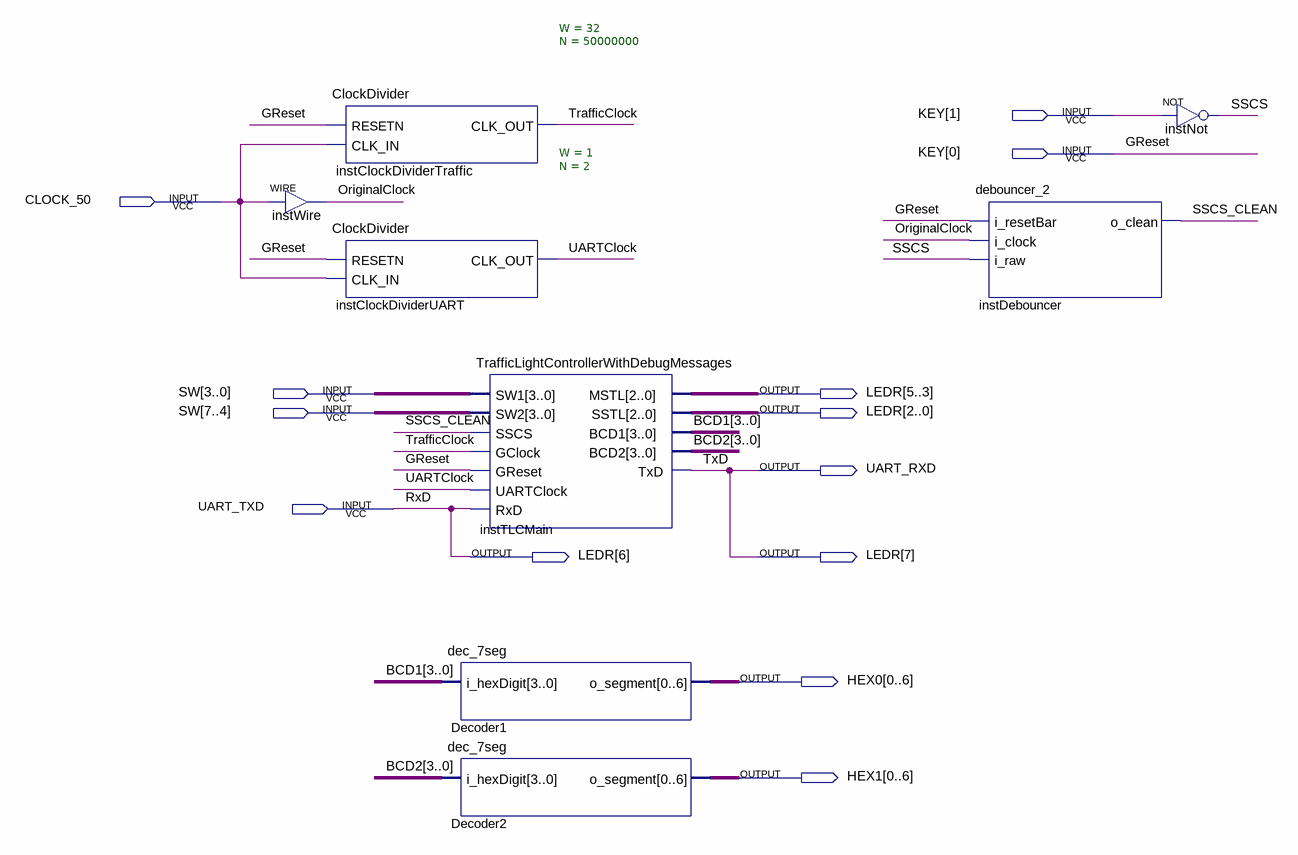
[diagram p0: schematic sheet]
// Quartus schematic Project.bdf as structural Verilog: 8 symbols, 13 pins
module Project (
  input  [1:0] KEY,
  input  CLOCK_50,
  input  [7:0] SW,
  input  UART_TXD,
  output [7:0] LEDR,
  output UART_RXD,
  output [0:6] HEX0,
  output [0:6] HEX1
);

  wire OriginalClock, SSCS, SSCS_CLEAN, TrafficClock, UARTClock;
  wire [3:0] BCD1, BCD2;

  assign OriginalClock = CLOCK_50;  // WIRE instWire
  ClockDivider #(.W(32), .N(50000000)) instClockDividerTraffic (
    .RESETN(KEY[0]), .CLK_IN(CLOCK_50), .CLK_OUT(TrafficClock));
  ClockDivider #(.W(1), .N(2)) instClockDividerUART (.RESETN(KEY[0]), .CLK_IN(CLOCK_50), .CLK_OUT(UARTClock));
  dec_7seg Decoder1 (.i_hexDigit(BCD1), .o_segment(HEX0));
  dec_7seg Decoder2 (.i_hexDigit(BCD2), .o_segment(HEX1));
  TrafficLightControllerWithDebugMessages instTLCMain (
    .SW1(SW[3:0]), .SW2(SW[7:4]), .SSCS(SSCS_CLEAN), .GClock(TrafficClock), .GReset(KEY[0]),
    .UARTClock(UARTClock), .RxD(UART_TXD), .MSTL(LEDR[5:3]), .SSTL(LEDR[2:0]), .BCD1(BCD1), .BCD2(BCD2),
    .TxD(LEDR[7]));
  debouncer_2 instDebouncer (.i_resetBar(KEY[0]), .i_clock(OriginalClock), .i_raw(SSCS), .o_clean(SSCS_CLEAN));
  not instNot (SSCS, KEY[1]);

  assign LEDR[6] = UART_TXD;
  assign UART_RXD = LEDR[7];

  // Other names for the same wires on the sheet: GReset = KEY[0]; RxD = UART_TXD; TxD = LEDR[7]
endmodule
